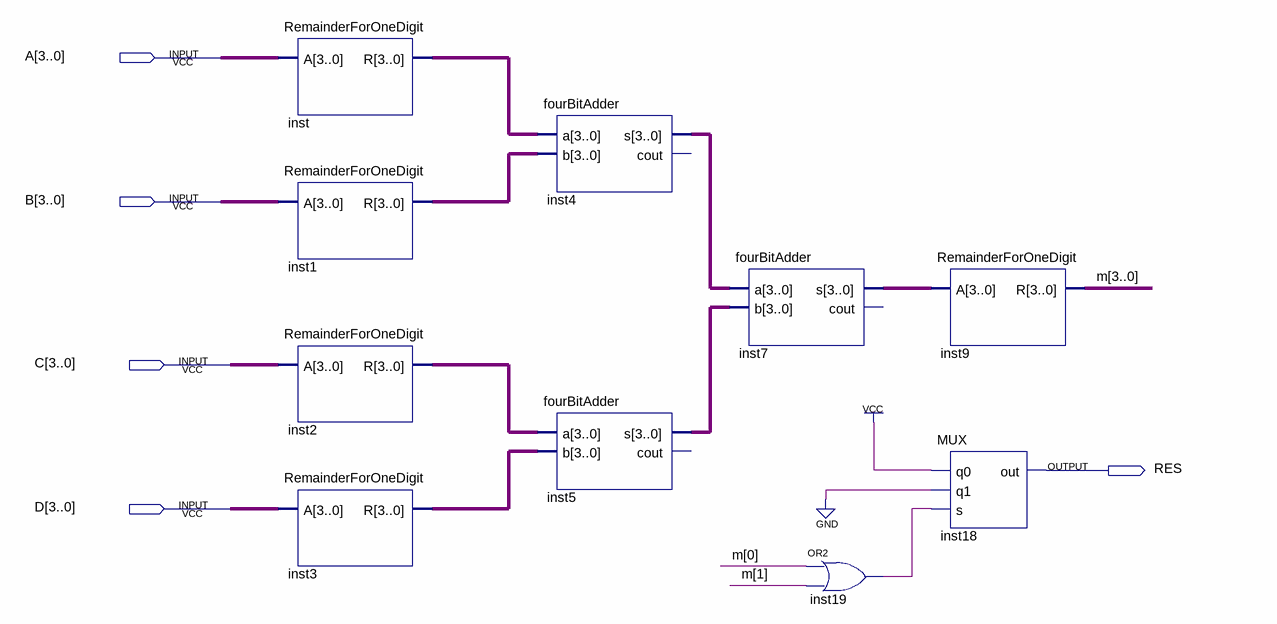
[diagram p0: schematic sheet]
// Quartus schematic RemainderOf3.bdf as structural Verilog: 10 symbols, 5 pins
module RemainderOf3 (
  input  [3:0] A,
  input  [3:0] B,
  input  [3:0] C,
  input  [3:0] D,
  output RES
);

  wire inst19_out;
  wire [3:0] inst1_r, inst2_r, inst3_r, inst4_s, inst5_s, inst7_s, inst_r, m;

  RemainderForOneDigit inst (.A(A), .R(inst_r));
  RemainderForOneDigit inst1 (.A(B), .R(inst1_r));
  RemainderForOneDigit inst2 (.A(C), .R(inst2_r));
  RemainderForOneDigit inst3 (.A(D), .R(inst3_r));
  fourBitAdder inst4 (.a(inst_r), .b(inst1_r), .s(inst4_s));  // open: cout
  fourBitAdder inst5 (.a(inst2_r), .b(inst3_r), .s(inst5_s));  // open: cout
  fourBitAdder inst7 (.a(inst4_s), .b(inst5_s), .s(inst7_s));  // open: cout
  or inst19 (inst19_out, m[0], m[1]);
  RemainderForOneDigit inst9 (.A(inst7_s), .R(m));
  MUX inst18 (.q0(1'b1), .q1(1'b0), .s(inst19_out), .out(RES));
endmodule
